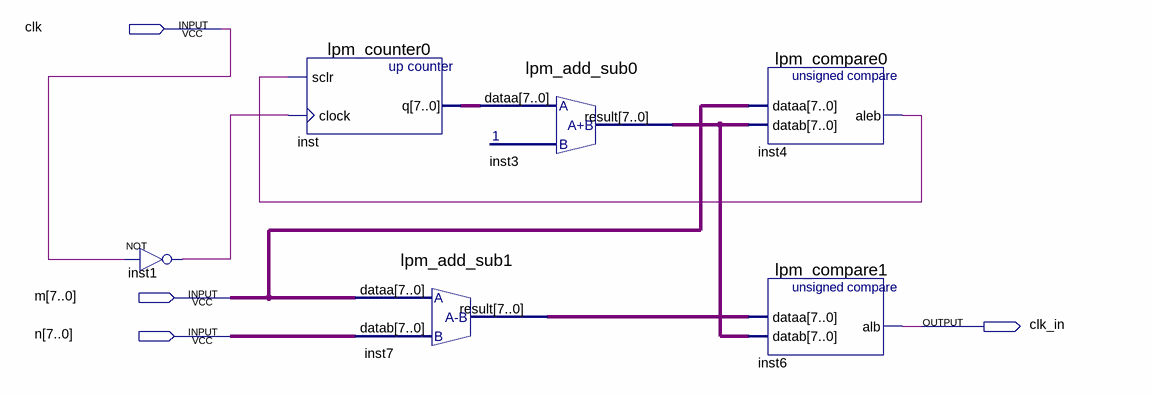
[diagram p0: schematic sheet]
// Quartus schematic Block1.bdf as structural Verilog: 6 symbols, 4 pins
module Block1 (
  input  clk,
  input  [7:0] m,
  input  [7:0] n,
  output clk_in
);

  wire inst1_out, inst4_aleb;
  wire [7:0] inst3_result, inst7_result, inst_q;

  not inst1 (inst1_out, clk);
  lpm_counter0 inst (.sclr(inst4_aleb), .clock(inst1_out), .q(inst_q));
  lpm_add_sub1 inst7 (.dataa(m), .datab(n), .result(inst7_result));
  lpm_add_sub0 inst3 (.dataa(inst_q), .result(inst3_result));
  lpm_compare0 inst4 (.dataa(m), .datab(inst3_result), .aleb(inst4_aleb));
  lpm_compare1 inst6 (.dataa(inst7_result), .datab(inst3_result), .alb(clk_in));
endmodule
